# Altium schematic sheet 10-Click.SchDoc
size 431 x 279 mm; Organization: ORGANIZATION; Address1: ADDRESS 1; Address2: ADDRESS 2; Address3: ADDRESS 3; Address4: ADDRESS 4; DocumentNumber: 11; Revision: -; SheetNumber: 10; SheetTotal: 14; ENG_APP_DATE: --/--/--; DSN_APP_DATE: --/--/--; CHK_APP_DATE: --/--/--
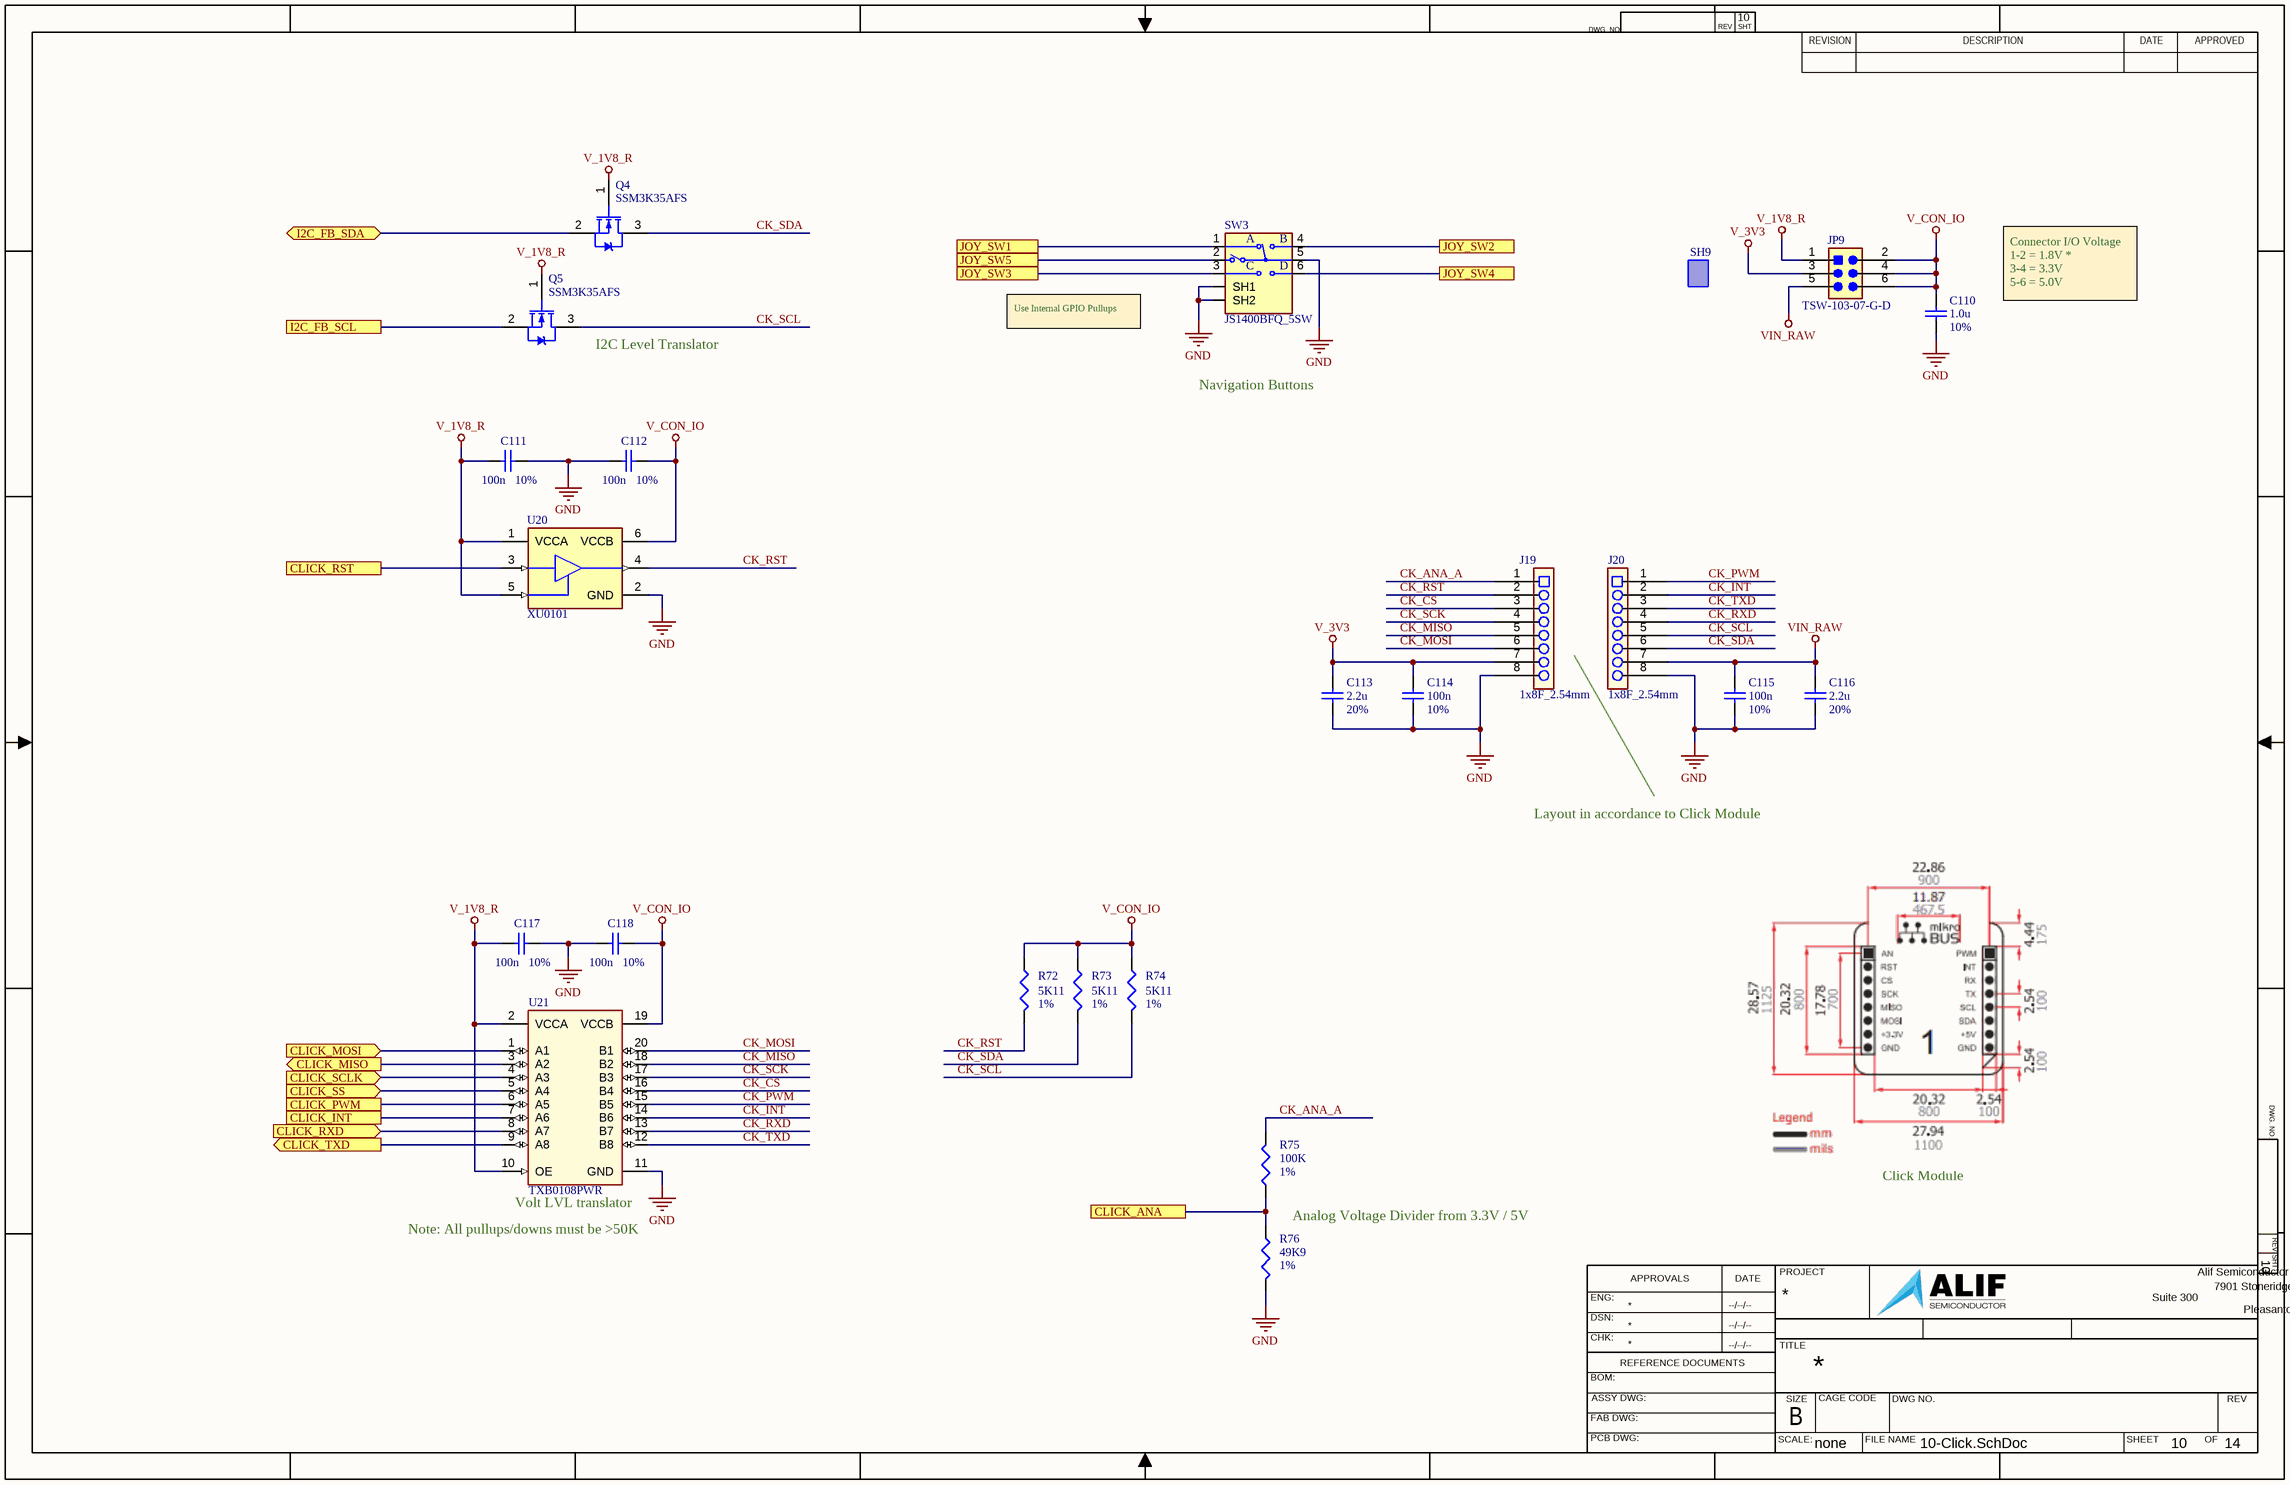
[diagram p0: 10-Click.SchDoc]

## Parts
C110  value 1.0u  Tolerance: 10%  [CAPC0402-01]  (hidden comment: Cap)
C111  value 100n  Tolerance: 10%  [CAPC0402-01]  (hidden comment: Cap)
C112  value 100n  Tolerance: 10%  [CAPC0402-01]  (hidden comment: Cap)
C113  value 2.2u  Tolerance: 20%  [CAPC0402-01]  (hidden comment: Cap_225M25VX5R0402_1)
C114  value 100n  Tolerance: 10%  [CAPC0402-01]  (hidden comment: Cap)
C115  value 100n  Tolerance: 10%  [CAPC0402-01]  (hidden comment: Cap)
C116  value 2.2u  Tolerance: 20%  [CAPC0402-01]  (hidden comment: Cap_225M25VX5R0402_1)
C117  value 100n  Tolerance: 10%  [CAPC0402-01]  (hidden comment: Cap)
C118  value 100n  Tolerance: 10%  [CAPC0402-01]  (hidden comment: Cap)
J19  value 1x8F_2.54mm  [RHDR8W80P0X254_1X8_2082X254X850P]  (hidden comment: Hdr_F_1x8_2.5MM_STRT_UNSH_1)
J20  value 1x8F_2.54mm  [RHDR8W80P0X254_1X8_2082X254X850P]  (hidden comment: Hdr_F_1x8_2.5MM_STRT_UNSH_1)
JP9  TSW-103-07-G-D  [HDRV6W64P254_2X3_762X508X838P]
Q4  Manufacturer Part Number 1: SSM3K35AFS  [SC75_SSM_TOS-L]  (hidden comment: NMOS-2_SOT)
Q5  Manufacturer Part Number 1: SSM3K35AFS  [SC75_SSM_TOS-L]  (hidden comment: NMOS-2_SOT)
R72  value 5K11  Tolerance: 1%  [RESC0402-01]  (hidden comment: Res3)
R73  value 5K11  Tolerance: 1%  [RESC0402-01]  (hidden comment: Res3)
R74  value 5K11  Tolerance: 1%  [RESC0402-01]  (hidden comment: Res3)
R75  value 100K  Tolerance: 1%  [RESC0402-01]  (hidden comment: Res3)
R76  value 49K9  Tolerance: 1%  [RESC0402-01]  (hidden comment: Res3)
SH9  Shunt  (value not drawn)  (mechanical)
SW3  JS1400BFQ_5SW  [SW_JS1400BFQ]
U20  XU0101  [SOT363_TI]
U21  TXB0108PWR  [TSSOP20_TI_PW0020A_M]

## Ports
CLICK_ANA, CLICK_INT, CLICK_MISO (out), CLICK_MOSI (in), CLICK_PWM, CLICK_RST, CLICK_RXD (in), CLICK_SCLK (in), CLICK_SS (in), CLICK_TXD (out), I2C_FB_SCL, I2C_FB_SDA (bidir), JOY_SW1, JOY_SW2, JOY_SW3, JOY_SW4, JOY_SW5

## Nets
GND: C110.1 C111.1 C112.2 C113.1 C114.1 C115.1 C116.1 C117.1 C118.2 J19.8 J20.8 R76.2 SW3.5(COM) SW3.SH1 SW3.SH2 U20.2(GND) U21.11(GND)
V_1V8_R: C111.2 C117.2 JP9.1 Q4.1(G) Q5.1(G) U20.1(VCCA) U20.5(OE) U21.2(VCCA) U21.10(OE)
V_3V3: C113.2 C114.2 J19.7 JP9.3
V_CON_IO: C110.2 C112.1 C118.1 JP9.2 JP9.4 JP9.6 R72.1 R73.1 R74.1 U20.6(VCCB) U21.19(VCCB)
VIN_RAW: C115.2 C116.2 J20.7 JP9.5
CK_ANA_A: J19.1 R75.2
CK_CS: J19.3 U21.16(B4)
CK_INT: J20.2 U21.14(B6)
CK_MISO: J19.5 U21.18(B2)
CK_MOSI: J19.6 U21.20(B1)
CK_PWM: J20.1 U21.15(B5)
CK_RST: J19.2 R72.2 U20.4(BY)
CK_RXD: J20.4 U21.13(B7)
CK_SCK: J19.4 U21.17(B3)
CK_SCL: J20.5 Q5.3(D) R74.2
CK_SDA: J20.6 Q4.3(D) R73.2
CK_TXD: J20.3 U21.12(B8)
CLICK_ANA: R75.1 R76.1 ; port CLICK_ANA
CLICK_INT: U21.7(A6) ; port CLICK_INT
CLICK_MISO: U21.3(A2) ; port CLICK_MISO
CLICK_MOSI: U21.1(A1) ; port CLICK_MOSI
CLICK_PWM: U21.6(A5) ; port CLICK_PWM
CLICK_RST: U20.3(A) ; port CLICK_RST
CLICK_RXD: U21.8(A7) ; port CLICK_RXD
CLICK_SCLK: U21.4(A3) ; port CLICK_SCLK
CLICK_SS: U21.5(A4) ; port CLICK_SS
CLICK_TXD: U21.9(A8) ; port CLICK_TXD
I2C_FB_SCL: Q5.2(S) ; port I2C_FB_SCL
I2C_FB_SDA: Q4.2(S) ; port I2C_FB_SDA
JOY_SW1: SW3.1(A) ; port JOY_SW1
JOY_SW2: SW3.4(B) ; port JOY_SW2
JOY_SW3: SW3.3(C) ; port JOY_SW3
JOY_SW4: SW3.6(D) ; port JOY_SW4
JOY_SW5: SW3.2(E) ; port JOY_SW5

## Notes on the sheet
- Connector I/O Voltage
  1-2 = 1.8V *
  3-4 = 3.3V
  5-6 = 5.0V
- (near Q5) I2C Level Translator
- Use Internal GPIO Pullups
- Navigation Buttons
- Layout in accordance to Click Module
- (near U21) Note: All pullups/downs must be >50K
- (near U21) Volt LVL translator
- Analog Voltage Divider from 3.3V / 5V
- Click Module
- DWG. NO.
- REV
- SHT
- REVISION
- DESCRIPTION
- DATE
- APPROVED
- ENG:
- APPROVALS
- PROJECT
- Suite 300
- Alif Semiconductor
- 7901 Stoneridge Drive
- DSN:
- CHK:
- REFERENCE DOCUMENTS
- TITLE
- Pleasanton, CA 94588  USA
- BOM:
- FAB DWG:
- PCB DWG:
- ASSY DWG:
- SCALE:
- SIZE
- B
- CAGE CODE
- FILE NAME
- DWG NO.
- SHEET
- OF
- none

## Library data of the parts
C110 = Cap: Cap,1.0uF,20%,25V,X5R,0402; Manufacturer 1: TDK; Manufacturer Part Number 1: CGB2A1X5R1E105K033BC; PCB_Footprint: CC0402; Published: 8-Jun-2000; LatestRevisionDate: 17-Jul-2002; LatestRevisionNote: Re-released for DXP Platform.; PackageReference: RAD-0.3; Publisher: Altium Limited; PackageDescription: Radial Cap, Thru-Hole; 2 Leads; 0.3 in Pin Spacing; Max_Height: 0.60mm; Manufacturer 2: Yageo; Manufacturer Part Number 2: CC0402KRX5R8BB105; Manufacturer 3: Murata; Manufacturer Part Number 3: GRM155R61E105KA12D; Type: X5R; Voltage: 25V
C111 C112 C114 C115 C117 C118 = Cap: Cap,100nF,10%,50V,X7R,0402; Manufacturer 1: TDK; Manufacturer Part Number 1: C1005X7R1H104K050BE; PCB_Footprint: CC0402; Published: 8-Jun-2000; LatestRevisionDate: 17-Jul-2002; LatestRevisionNote: Re-released for DXP Platform.; PackageReference: RAD-0.3; Publisher: Altium Limited; PackageDescription: Radial Cap, Thru-Hole; 2 Leads; 0.3 in Pin Spacing; Max_Height: 0.60mm; Manufacturer 2: Samsung; Manufacturer Part Number 2: CL05B104KB54PNC; Manufacturer 3: Walsin; Manufacturer Part Number 3: 0402B104K500CT; Type: X7R; Voltage: 50V
C113 C116 = Cap_225M25VX5R0402_1: Cap,2.2uF,20%,25V,X5R,0402; Manufacturer 1: TDK; Manufacturer Part Number 1: C1005X5R1E225M050BC; PCB_Footprint: CC0402; Published: 8-Jun-2000; LatestRevisionDate: 17-Jul-2002; LatestRevisionNote: Re-released for DXP Platform.; PackageReference: RAD-0.3; Publisher: Altium Limited; PackageDescription: Radial Cap, Thru-Hole; 2 Leads; 0.3 in Pin Spacing; Max_Height: 0.60mm; Type: X5R; Voltage: 25V; Manufacturer 2: Murata; Manufacturer Part Number 2: GRM155R61E225ME11D; Manufacturer 3: Murata; Manufacturer Part Number 3: GRM155R61E225ME15D
J19 J20 = Hdr_F_1x8_2.5MM_STRT_UNSH_1: Hdr,Female,1x8,2.54mm,Strt,Unshrouded; Manufacturer 1: Sullins; Manufacturer Part Number 1: PPPC081LFBN-RC
JP9 = Hdr_M_2X3_2M54_STRT_UNSHROUDED: Hdr, Male,2x3, 2.54mm,0.230mate,0.100-0.120post,, Strt; Manufacturer 1: Samtec; Manufacturer Part Number 1: TSW-103-07-L-D; PCB_Footprint: *
Q4 Q5 = NMOS-2_SOT: MOSFET,N-CH,20V,250mA,1.1Ohm,SOT-23; Manufacturer 1: Toshiba; Note: Pin 2 is electrically connected to pin 4.; Value: 20V  180mA  2.4Ohm; Published: 8-Jun-2000; LatestRevisionDate: 17-Jul-2002; LatestRevisionNote: Re-released for DXP Platform.; DatasheetVersion: PD-9.814; PackageVersion: Feb-1997; PackageReference: TO-220AB; Publisher: Altium Limited; PackageDescription: TO, Thru-Hole, Vertical, Heatsink Mounted; 3 In-Line Leads; Pitch 2.54 mm; ComponentLink1Description: Manufacturer Link; ComponentLink1URL: http://www.irf.com/; Manufacturer 2: Rohm; Manufacturer Part Number 2: RUE002N02TL; Manufacturer 3: *; Manufacturer Part Number 3: *
R72-R74 = Res3: Res,5K11,1%,100ppm,0402; Manufacturer 1: KOA; Manufacturer Part Number 1: RK73H1ETTP5111F; Wattage: 63mW; Published: 8-Jun-2000; LatestRevisionDate: 29-May-2009; LatestRevisionNote: IPC-7351 Footprint Added.; PackageReference: RESC0402-01; Publisher: Altium Limited; PackageDescription: Chip Resistor; Voltage: *; Type: Thick Film; Manufacturer 2: Yageo; Manufacturer Part Number 2: RC0402FR-075K11L; Manufacturer 3: Bourns; Manufacturer Part Number 3: CR0402-FX-5111GLF; PCB_Footprint: RESC0402-01
R75 = Res3: Res,100K,1%,100ppm,0402; Manufacturer 1: Stackpol; Manufacturer Part Number 1: RMCF0402FT100K; Wattage: 63mW; Published: 8-Jun-2000; LatestRevisionDate: 29-May-2009; LatestRevisionNote: IPC-7351 Footprint Added.; PackageReference: RESC0402-01; Publisher: Altium Limited; PackageDescription: Chip Resistor; Voltage: *; Type: Thick Film; Manufacturer 2: Yageo; Manufacturer Part Number 2: RC0402FR-07100KL; Manufacturer 3: Bourns; Manufacturer Part Number 3: CR0402-FX-1003GLF; PCB_Footprint: RESC0402-01
R76 = Res3: Res,49K9,1%,100ppm,0402; Manufacturer 1: Stackpol; Manufacturer Part Number 1: RMCF0402FT49K9; Wattage: 63mW; Published: 8-Jun-2000; LatestRevisionDate: 29-May-2009; LatestRevisionNote: IPC-7351 Footprint Added.; PackageReference: RESC0402-01; Publisher: Altium Limited; PackageDescription: Chip Resistor; Voltage: *; Type: Thick Film; Manufacturer 2: Yageo; Manufacturer Part Number 2: RC0402FR-0749K9L; Manufacturer 3: Bourns; Manufacturer Part Number 3: CR0402-FX-4992GLF; PCB_Footprint: RESC0402-01
SH9 = SHUNT_F_1x2_2.5MM_STRT: Shunt,Female,1x2,2.54mm,Gold,Strt; Manufacturer 1: Samtec; Manufacturer Part Number 1: SNT-100-BK-H; Manufacturer 2: Adam Tech; Manufacturer Part Number 2: MSB-G
SW3 = JS1400BFQ_5SW: Navigation Switch, 2 - Axis Digital (Mechanical Switch) Output; Manufacturer 1: ESwitch; MF: E-Switch; Digi-Key_Part_Number: EG5858-ND; MP: JS1400BFQ; Value: *; SnapEDA_Link: https://www.snapeda.com/parts/JS1400BFQ/E-Switch/view-part/2768291/?ref=snap; Package: None; Manufacturer Part Number 1: JS1400BFQ; Manufacturer 2: Diptronics; Manufacturer Part Number 2: MT5-1F-V
U20 = IC_XLAT_TXU0101DCKR: IC, Voltage Level Translator, Uni-Dir, 1-bit,push-pull,200MHz,VCCI: 1.2V to 5V and VCCO: 1.2V to 5V,SOT363; Manufacturer 1: TI; Manufacturer Part Number 1: TXU0101DCKR; Manufacturer 2: Nexperia; Manufacturer Part Number 2: NXU0101GWH; Manufacturer 3: Nexperia; Manufacturer Part Number 3: NXU0101GW-Q100H
U21 = IC_XLAT_TXB0108PWR: IC, Voltage Level Translator, 8-bit,push-pull,100Mbps,VCC(A): 1.2V to 3.6V and VCC(B): 1.65V to 5.5V,auto-sense,TSSOP20; Manufacturer 1: TI; TYPE: TYPE; Manufacturer Part Number 1: TXB0108PWR; Manufacturer 2: TI; Manufacturer Part Number 2: TXB0108PWRG4